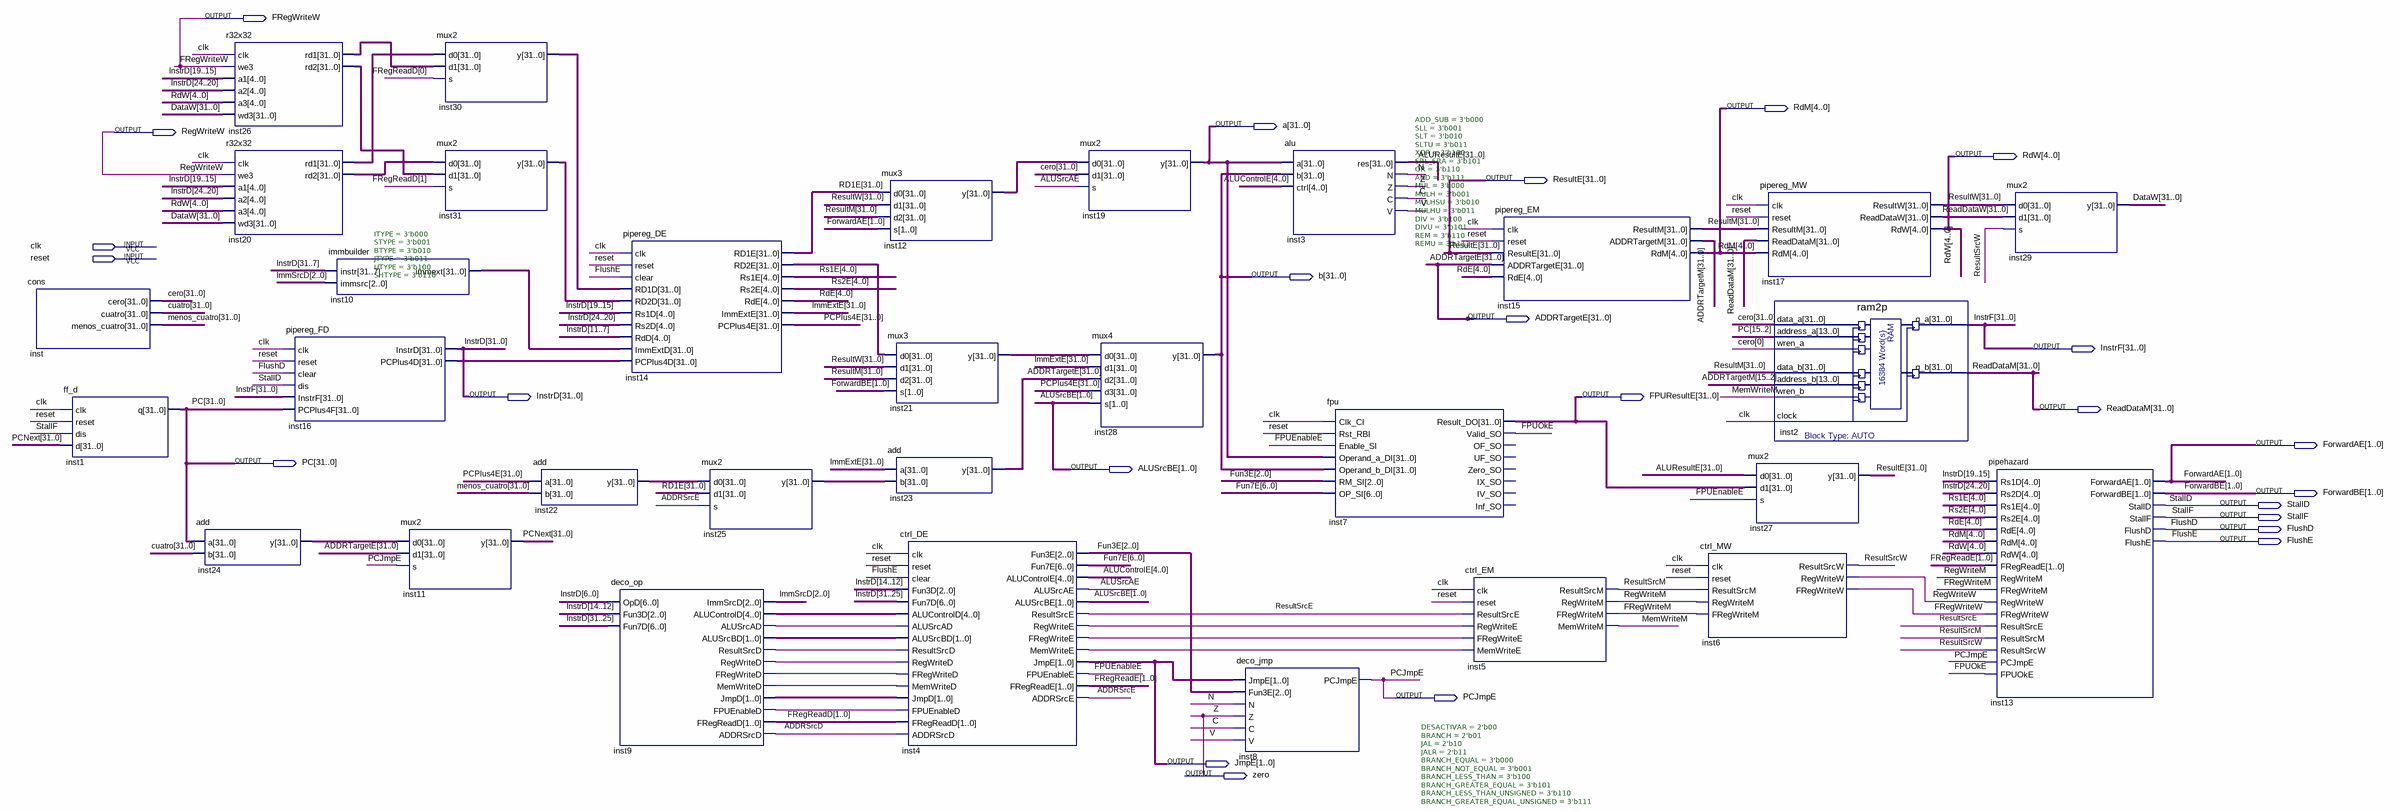
[diagram p0: schematic sheet]
// Quartus schematic top.bdf as structural Verilog: 31 symbols, 25 pins
module top (
  input  clk,
  input  reset,
  output FRegWriteW,
  output [4:0] RdM,
  output [31:0] a,
  output RegWriteW,
  output [4:0] RdW,
  output [31:0] ResultE,
  output [31:0] b,
  output [31:0] ADDRTargetE,
  output [31:0] InstrF,
  output [31:0] InstrD,
  output [31:0] FPUResultE,
  output [31:0] ReadDataM,
  output [1:0] ForwardAE,
  output [31:0] PC,
  output [1:0] ALUSrcBE,
  output [1:0] ForwardBE,
  output StallD,
  output StallF,
  output FlushD,
  output FlushE,
  output PCJmpE,
  output [1:0] JmpE,
  output zero
);

  wire ADDRSrcD, ADDRSrcE, ALUSrcAE, C, FPUEnableE, FPUOkE, FRegWriteM, inst4_fregwritee, inst4_memwritee,
       inst4_regwritee, inst9_alusrcad, inst9_fpuenabled, inst9_fregwrited, inst9_memwrited, inst9_regwrited,
       inst9_resultsrcd, MemWriteM, N, RegWriteM, ResultSrcE, ResultSrcM, ResultSrcW, V, Z;
  wire [1:0] FRegReadD, FRegReadE, inst9_alusrcbd, inst9_jmpd;
  wire [2:0] Fun3E, ImmSrcD;
  wire [4:0] ALUControlE, inst9_alucontrold, RdE, Rs1E, Rs2E;
  wire [6:0] Fun7E;
  wire [31:0] ADDRTargetM, ALUResultE, cero, cuatro, DataW, ImmExtE, inst10_immext, inst12_y, inst14_rd2e,
       inst16_pcplus4d, inst20_rd1, inst20_rd2, inst21_y, inst22_y, inst24_y, inst25_y, inst26_rd1,
       inst26_rd2, inst30_y, inst31_y, menos_cuatro, PCNext, PCPlus4E, RD1E, ReadDataW, ResultM, ResultW;

  cons inst (.cero(cero), .cuatro(cuatro), .menos_cuatro(menos_cuatro));
  ff_d inst1 (.clk(clk), .reset(reset), .dis(StallF), .d(PCNext), .q(PC));
  r32x32 inst26 (
    .clk(clk), .we3(FRegWriteW), .a1(InstrD[19:15]), .a2(InstrD[24:20]), .a3(RdW), .wd3(DataW),
    .rd1(inst26_rd1), .rd2(inst26_rd2));
  r32x32 inst20 (
    .clk(clk), .we3(RegWriteW), .a1(InstrD[19:15]), .a2(InstrD[24:20]), .a3(RdW), .wd3(DataW),
    .rd1(inst20_rd1), .rd2(inst20_rd2));
  add inst24 (.a(PC), .b(cuatro), .y(inst24_y));
  pipereg_FD inst16 (
    .clk(clk), .reset(reset), .clear(FlushD), .dis(StallD), .InstrF(InstrF), .PCPlus4F(PC), .InstrD(InstrD),
    .PCPlus4D(inst16_pcplus4d));
  immbuilder #(.ITYPE(3'b000), .STYPE(3'b001), .BTYPE(3'b010), .JTYPE(3'b011), .UTYPE(3'b100), .SHTYPE(3'b110)) inst10 (
    .instr(InstrD[31:7]), .immsrc(ImmSrcD), .immext(inst10_immext));
  mux2 inst11 (.d0(inst24_y), .d1(ADDRTargetE), .s(PCJmpE), .y(PCNext));
  mux2 inst30 (.d0(inst20_rd1), .d1(inst26_rd1), .s(FRegReadD[0]), .y(inst30_y));
  mux2 inst31 (.d0(inst20_rd2), .d1(inst26_rd2), .s(FRegReadD[1]), .y(inst31_y));
  add inst22 (.a(PCPlus4E), .b(menos_cuatro), .y(inst22_y));
  deco_op inst9 (
    .OpD(InstrD[6:0]), .Fun3D(InstrD[14:12]), .Fun7D(InstrD[31:25]), .ImmSrcD(ImmSrcD),
    .ALUControlD(inst9_alucontrold), .ALUSrcAD(inst9_alusrcad), .ALUSrcBD(inst9_alusrcbd),
    .ResultSrcD(inst9_resultsrcd), .RegWriteD(inst9_regwrited), .FRegWriteD(inst9_fregwrited),
    .MemWriteD(inst9_memwrited), .JmpD(inst9_jmpd), .FPUEnableD(inst9_fpuenabled), .FRegReadD(FRegReadD),
    .ADDRSrcD(ADDRSrcD));
  pipereg_DE inst14 (
    .clk(clk), .reset(reset), .clear(FlushE), .RD1D(inst30_y), .RD2D(inst31_y), .Rs1D(InstrD[19:15]),
    .Rs2D(InstrD[24:20]), .RdD(InstrD[11:7]), .ImmExtD(inst10_immext), .PCPlus4D(inst16_pcplus4d),
    .RD1E(RD1E), .RD2E(inst14_rd2e), .Rs1E(Rs1E), .Rs2E(Rs2E), .RdE(RdE), .ImmExtE(ImmExtE),
    .PCPlus4E(PCPlus4E));
  mux2 inst25 (.d0(inst22_y), .d1(RD1E), .s(ADDRSrcE), .y(inst25_y));
  mux3 inst12 (.d0(RD1E), .d1(ResultW), .d2(ResultM), .s(ForwardAE), .y(inst12_y));
  mux3 inst21 (.d0(inst14_rd2e), .d1(ResultW), .d2(ResultM), .s(ForwardBE), .y(inst21_y));
  add inst23 (.a(ImmExtE), .b(inst25_y), .y(ADDRTargetE));
  ctrl_DE inst4 (
    .clk(clk), .reset(reset), .clear(FlushE), .Fun3D(InstrD[14:12]), .Fun7D(InstrD[31:25]),
    .ALUControlD(inst9_alucontrold), .ALUSrcAD(inst9_alusrcad), .ALUSrcBD(inst9_alusrcbd),
    .ResultSrcD(inst9_resultsrcd), .RegWriteD(inst9_regwrited), .FRegWriteD(inst9_fregwrited),
    .MemWriteD(inst9_memwrited), .JmpD(inst9_jmpd), .FPUEnableD(inst9_fpuenabled), .FRegReadD(FRegReadD),
    .ADDRSrcD(ADDRSrcD), .Fun3E(Fun3E), .Fun7E(Fun7E), .ALUControlE(ALUControlE), .ALUSrcAE(ALUSrcAE),
    .ALUSrcBE(ALUSrcBE), .ResultSrcE(ResultSrcE), .RegWriteE(inst4_regwritee), .FRegWriteE(inst4_fregwritee),
    .MemWriteE(inst4_memwritee), .JmpE(JmpE), .FPUEnableE(FPUEnableE), .FRegReadE(FRegReadE),
    .ADDRSrcE(ADDRSrcE));
  mux2 inst19 (.d0(inst12_y), .d1(cero), .s(ALUSrcAE), .y(a));
  mux4 inst28 (.d0(inst21_y), .d1(ImmExtE), .d2(ADDRTargetE), .d3(PCPlus4E), .s(ALUSrcBE), .y(b));
  deco_jmp #(.DESACTIVAR(2'b00), .BRANCH(2'b01), .JAL(2'b10), .JALR(2'b11), .BRANCH_EQUAL(3'b000), .BRANCH_NOT_EQUAL(3'b001), .BRANCH_LESS_THAN(3'b100), .BRANCH_GREATER_EQUAL(3'b101), .BRANCH_LESS_THAN_UNSIGNED(3'b110), .BRANCH_GREATER_EQUAL_UNSIGNED(3'b111)) inst8 (
    .JmpE(JmpE), .Fun3E(Fun3E), .N(N), .Z(Z), .C(C), .V(V), .PCJmpE(PCJmpE));
  alu #(.ADD_SUB(3'b000), .SLL(3'b001), .SLT(3'b010), .SLTU(3'b011), .XOR(3'b100), .SRL_SRA(3'b101), .OR(3'b110), .AND(3'b111), .MUL(3'b000), .MULH(3'b001), .MULHSU(3'b010), .MULHU(3'b011), .DIV(3'b100), .DIVU(3'b101), .REM(3'b110), .REMU(3'b111)) inst3 (
    .a(a), .b(b), .ctrl(ALUControlE), .res(ALUResultE), .N(N), .Z(Z), .C(C), .V(V));
  fpu inst7 (
    .Clk_CI(clk), .Rst_RBI(reset), .Enable_SI(FPUEnableE), .Operand_a_DI(a), .Operand_b_DI(b), .RM_SI(Fun3E),
    .OP_SI(Fun7E), .Result_DO(FPUResultE), .Valid_SO(FPUOkE));  // open: OF_SO, UF_SO, Zero_SO, IX_SO, IV_SO, Inf_SO
  ctrl_EM inst5 (
    .clk(clk), .reset(reset), .ResultSrcE(ResultSrcE), .RegWriteE(inst4_regwritee),
    .FRegWriteE(inst4_fregwritee), .MemWriteE(inst4_memwritee), .ResultSrcM(ResultSrcM),
    .RegWriteM(RegWriteM), .FRegWriteM(FRegWriteM), .MemWriteM(MemWriteM));
  pipereg_EM inst15 (
    .clk(clk), .reset(reset), .ResultE(ResultE), .ADDRTargetE(ADDRTargetE), .RdE(RdE), .ResultM(ResultM),
    .ADDRTargetM(ADDRTargetM), .RdM(RdM));
  ctrl_MW inst6 (
    .clk(clk), .reset(reset), .ResultSrcM(ResultSrcM), .RegWriteM(RegWriteM), .FRegWriteM(FRegWriteM),
    .ResultSrcW(ResultSrcW), .RegWriteW(RegWriteW), .FRegWriteW(FRegWriteW));
  pipereg_MW inst17 (
    .clk(clk), .reset(reset), .ResultM(ResultM), .ReadDataM(ReadDataM), .RdM(RdM), .ResultW(ResultW),
    .ReadDataW(ReadDataW), .RdW(RdW));
  mux2 inst27 (.d0(ALUResultE), .d1(FPUResultE), .s(FPUEnableE), .y(ResultE));
  ram2p inst2 (
    .data_a(cero), .address_a(PC[15:2]), .wren_a(cero[0]), .data_b(ResultM), .address_b(ADDRTargetM[15:2]),
    .wren_b(MemWriteM), .clock(clk), .q_a(InstrF), .q_b(ReadDataM));
  mux2 inst29 (.d0(ResultW), .d1(ReadDataW), .s(ResultSrcW), .y(DataW));
  pipehazard inst13 (
    .Rs1D(InstrD[19:15]), .Rs2D(InstrD[24:20]), .Rs1E(Rs1E), .Rs2E(Rs2E), .RdE(RdE), .RdM(RdM), .RdW(RdW),
    .FRegReadE(FRegReadE), .RegWriteM(RegWriteM), .FRegWriteM(FRegWriteM), .RegWriteW(RegWriteW),
    .FRegWriteW(FRegWriteW), .ResultSrcE(ResultSrcE), .ResultSrcM(ResultSrcM), .ResultSrcW(ResultSrcW),
    .PCJmpE(PCJmpE), .FPUOkE(FPUOkE), .ForwardAE(ForwardAE), .ForwardBE(ForwardBE), .StallD(StallD),
    .StallF(StallF), .FlushD(FlushD), .FlushE(FlushE));
endmodule
